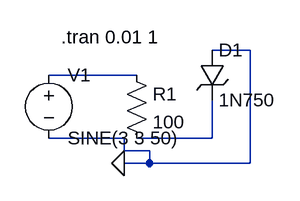
[diagram p0: schematic Draft7.asc]
Draft7.asc, the LTspice schematic file:
Version 4
SHEET 1 880 680
WIRE 400 256 352 256
WIRE 256 288 144 288
WIRE 240 368 144 368
WIRE 352 368 352 320
WIRE 352 368 256 368
WIRE 240 384 240 368
WIRE 272 384 240 384
WIRE 272 400 272 384
WIRE 272 400 240 400
WIRE 400 400 400 256
WIRE 400 400 272 400
FLAG 240 400 0
SYMBOL zener 336 256 R0
SYMATTR InstName D1
SYMATTR Value 1N750
SYMBOL voltage 144 272 R0
SYMATTR InstName V1
SYMATTR Value SINE(3 3 50)
SYMBOL res 240 272 R0
SYMATTR InstName R1
SYMATTR Value 100
TEXT 160 240 Left 2 !.tran 0.01 1

The netlist it stands for:
* Draft7.asc
D1 0 N002 1N750
V1 N001 0 SINE(3 3 50)
R1 N001 N002 100
.model D D
.lib standard.dio
.tran 0.01 1
.backanno
.end